# EAGLE design untitled (EAGLE 9.6.2)
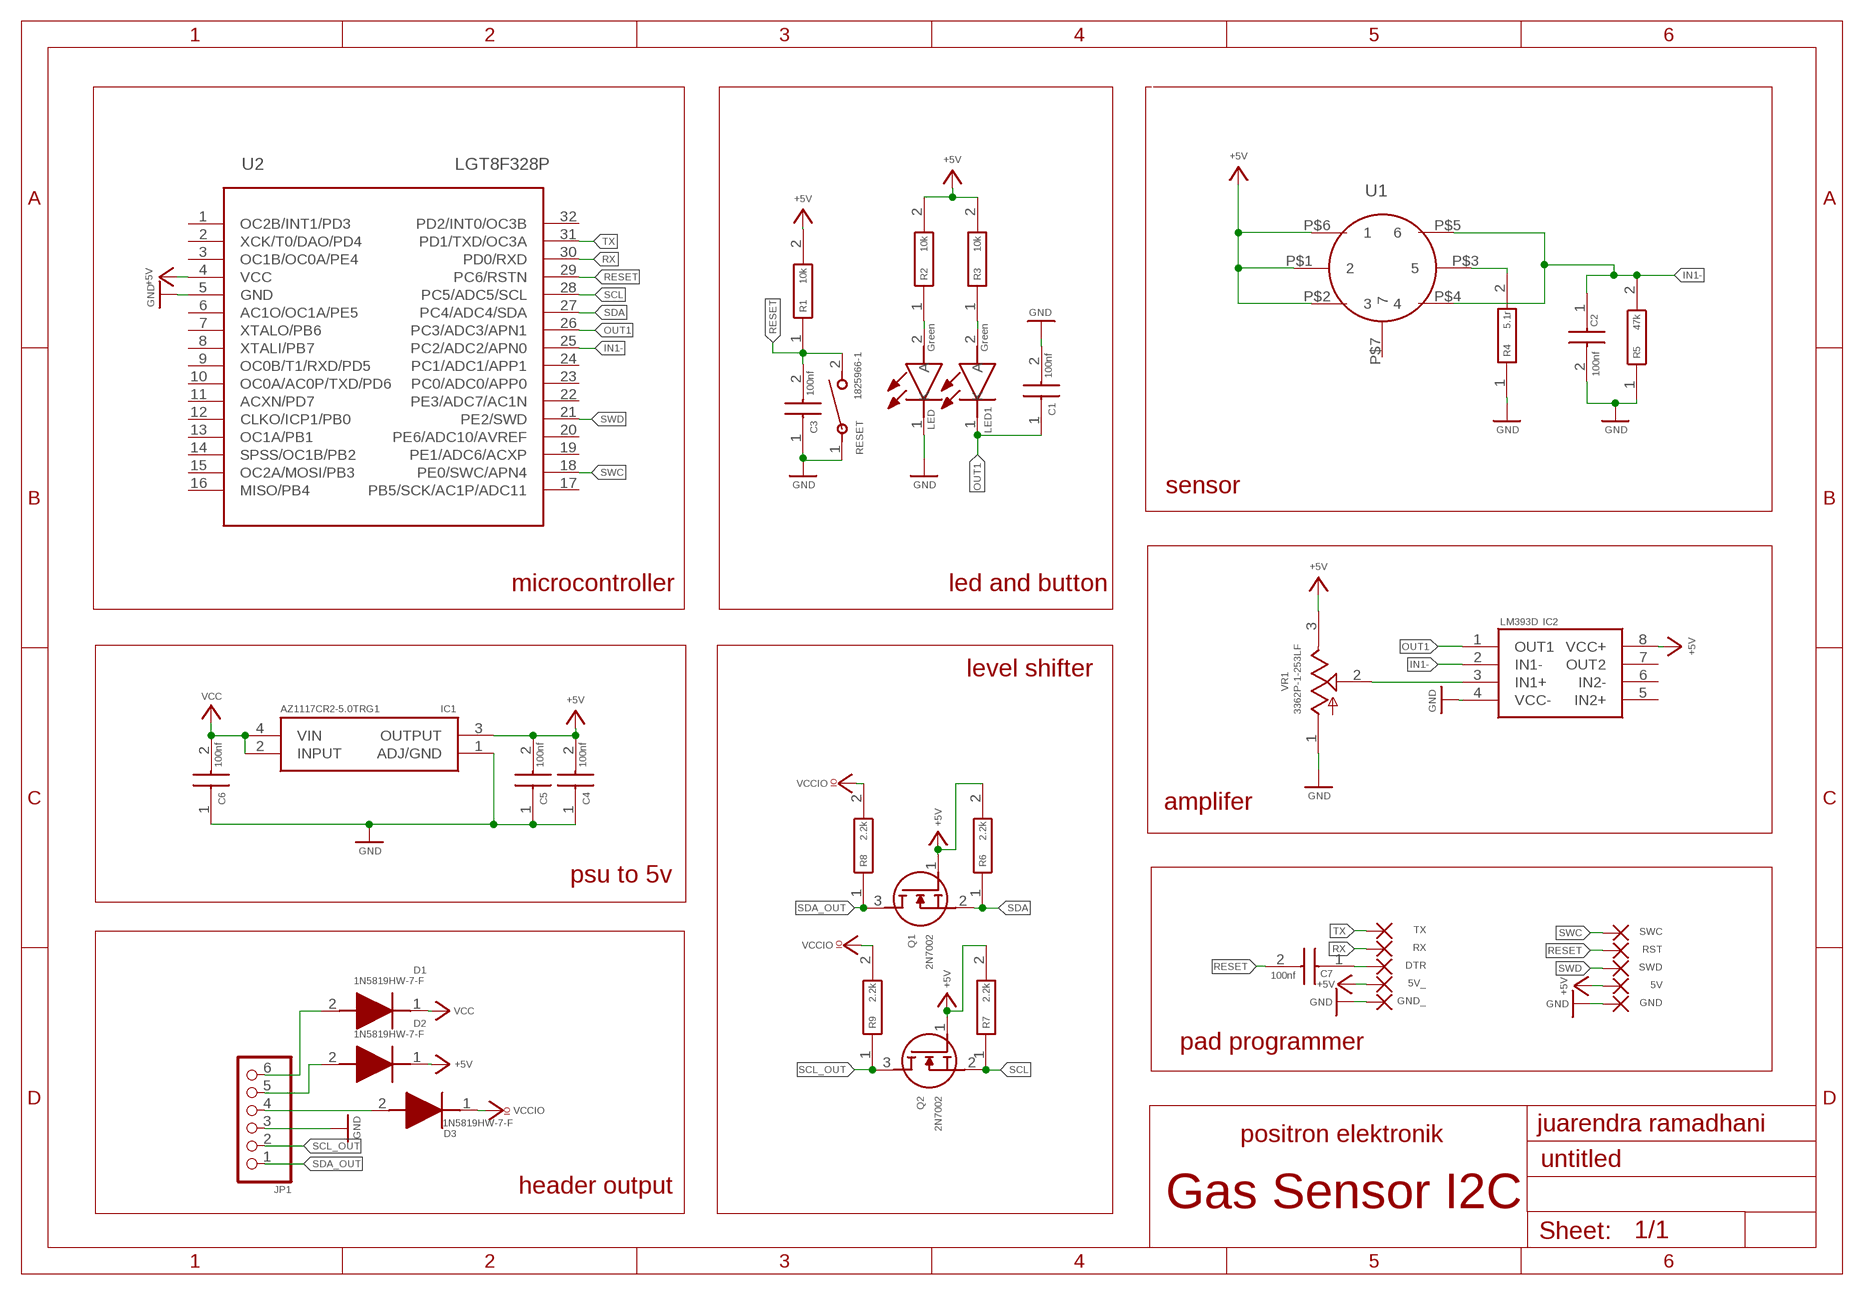
[diagram p0: schematic, sheet 1]

## Parts
5V  SMD2  [SMD1,27-2,54]
5V_  SMD2  [SMD1,27-2,54]
C1  100nf  CGA3E3X7S2A104M080AB  [CAPC1608X90N]
C2  100nf  CGA3E3X7S2A104M080AB  [CAPC1608X90N]
C3  100nf  CGA3E3X7S2A104M080AB  [CAPC1608X90N]
C4  100nf  CGA3E3X7S2A104M080AB  [CAPC1608X90N]
C5  100nf  CGA3E3X7S2A104M080AB  [CAPC1608X90N]
C6  100nf  CGA3E3X7S2A104M080AB  [CAPC1608X90N]
C7  100nf  CGA3E3X7S2A104M080AB  [CAPC1608X90N]
D1  1N5819HW-7-F  [SOD3716X145N]
D2  1N5819HW-7-F  [SOD3716X145N]
D3  1N5819HW-7-F  [SOD3716X145N]
DTR  SMD2  [SMD1,27-2,54]
GND  SMD2  [SMD1,27-2,54]
GND_  SMD2  [SMD1,27-2,54]
IC1  AZ1117CR2-5.0TRG1  [AP738133Y13]
IC2  LM393D  [SOIC127P600X175-8N]
JP1  PINHD-1X6  [1X06]
LED  Green  150080BS75000  [LEDC2012X80N]
LED1  Green  150080BS75000  [LEDC2012X80N]
Q1  2N7002  [SOT95P280X125-3N]
Q2  2N7002  [SOT95P280X125-3N]
R1  10k  CRCW060310K0FKEI  [RESC1608X50N]
R2  10k  CRCW060310K0FKEI  [RESC1608X50N]
R3  10k  CRCW060310K0FKEI  [RESC1608X50N]
R4  5.1r  RT0603DRE075R1L  [RESC1608X55N]
R5  47k  AC0603FR-7W47KL  [RESC1608X55N]
R6  2.2k  CR0603-FX-2201ELF  [RESC1608X55N]
R7  2.2k  CR0603-FX-2201ELF  [RESC1608X55N]
R8  2.2k  CR0603-FX-2201ELF  [RESC1608X55N]
R9  2.2k  CR0603-FX-2201ELF  [RESC1608X55N]
RESET  1825966-1  [SWDIP2_256X170P100]
RST  SMD2  [SMD1,27-2,54]
RX  SMD2  [SMD1,27-2,54]
SWC  SMD2  [SMD1,27-2,54]
SWD  SMD2  [SMD1,27-2,54]
TX  SMD2  [SMD1,27-2,54]
U1  MQ-SOCKET  [TQFP32-08]
U2  LGT8F328P  [TQFP32-08]
VR1  3362P-1-253LF  [TRIM_3362P-1-253LF]

## Nets
+5V: 5V.1(P) 5V_.1(P) C4.2 C5.2 D2.1(K) IC1.3(OUTPUT) IC2.8(VCC+) Q1.1(G) Q2.1(G) R1.2 R2.2 R3.2 R6.2 R7.2 U1.P$1 U1.P$2 U1.P$6 U2.4(VCC) VR1.3(CW)
GND: C1.2 C2.2 C3.1 C4.1 C5.1 C6.1 GND.1(P) GND_.1(P) IC1.1(ADJ/GND) IC2.4(VCC-) JP1.3 LED.1(K) R4.1 R5.1 RESET.1 U2.5(GND) VR1.1(CCW)
IN1-: C2.1 IC2.2(IN1-) R5.2 U1.P$4 U1.P$5 U2.25(PC2/ADC2/APN0)
N$1: LED.2(A) R2.1
N$2: LED1.2(A) R3.1
N$3: R4.2 U1.P$3
N$4: D1.2(A) JP1.6
N$5: D3.2(A) JP1.4
N$6: IC2.3(IN1+) VR1.2(WIPER)
N$7: D2.2(A) JP1.5
N$8: C7.1 DTR.1(P)
OUT1: C1.1 IC2.1(OUT1) LED1.1(K) U2.26(PC3/ADC3/APN1)
RESET: C3.2 C7.2 R1.1 RESET.2 RST.1(P) U2.29(PC6/RSTN)
RX: RX.1(P) U2.30(PD0/RXD)
SCL: Q2.2(S) R7.1 U2.28(PC5/ADC5/SCL)
SCL_OUT: JP1.2 Q2.3(D) R9.1
SDA: Q1.2(S) R6.1 U2.27(PC4/ADC4/SDA)
SDA_OUT: JP1.1 Q1.3(D) R8.1
SWC: SWC.1(P) U2.18(PE0/SWC/APN4)
SWD: SWD.1(P) U2.21(PE2/SWD)
TX: TX.1(P) U2.31(PD1/TXD/OC3A)
VCC: C6.2 D1.1(K) IC1.2(INPUT) IC1.4(VIN)
VCCIO: D3.1(K) R8.2 R9.2
Unconnected: IC2.5(IN2+) IC2.6(IN2-) IC2.7(OUT2) U1.P$7 U2.1(OC2B/INT1/PD3) U2.2(XCK/T0/DAO/PD4) U2.3(OC1B/OC0A/PE4) U2.6(AC1O/OC1A/PE5) U2.7(XTALO/PB6) U2.8(XTALI/PB7) U2.9(OC0B/T1/RXD/PD5) U2.10(OC0A/AC0P/TXD/PD6) U2.11(ACXN/PD7) U2.12(CLKO/ICP1/PB0) U2.13(OC1A/PB1) U2.14(SPSS/OC1B/PB2) U2.15(OC2A/MOSI/PB3) U2.16(MISO/PB4) U2.17(PB5/SCK/AC1P/ADC11) U2.19(PE1/ADC6/ACXP) U2.20(PE6/ADC10/AVREF) U2.22(PE3/ADC7/AC1N) U2.23(PC0/ADC0/APP0) U2.24(PC1/ADC1/APP1) U2.32(PD2/INT0/OC3B)

## Notes on the sheet
- sensor
- microcontroller | led and button
- level shifter
- amplifer
- psu to 5v
- pad programmer
- juarendra ramadhani
- positron elektronik
- header output
- Gas Sensor I2C

## Library data of the parts
5V 5V_ DTR GND GND_ RST RX SWC SWD TX = wirepad1:SMD2: SMD PAD
C1-C7 = CGA3E3X7S2A104M080AB:CGA3E3X7S2A104M080AB: Multilayer Ceramic Chip Capacitors, Capacitance=0.1uF, LxWxT:1.6x0.8x0.8mm Source: Datasheet; DESCRIPTION: Multilayer Ceramic Chip Capacitors, Capacitance=0.1uF, LxWxT:1.6x0.8x0.8mm; HEIGHT: 0.9mm; MANUFACTURER_NAME: TDK; MANUFACTURER_PART_NUMBER: CGA3E3X7S2A104M080AB; MOUSER_PART_NUMBER: 810-CGA3E3X7S2A104AB; MOUSER_PRICE-STOCK: https://www.mouser.co.uk/ProductDetail/TDK/CGA3E3X7S2A104M080AB?qs=6JAMGB%252BEdkwRRFLL6ULUHQ%3D%3D
D1-D3 = 1N5819HW-7-F:1N5819HW-7-F: Diode Schottky 1A 40V SOD123 Diodes Inc 1N5819HW-7-F, SMT Schottky Diode, 40V 1A, 2-Pin SOD-123 Source: Datasheet <https://www.diodes.com//assets/Datasheets/1N5819HW.pdf>; DESCRIPTION: Diode Schottky 1A 40V SOD123 Diodes Inc 1N5819HW-7-F, SMT Schottky Diode, 40V 1A, 2-Pin SOD-123; HEIGHT: 1.45mm; MANUFACTURER_NAME: Diodes Incorporated; MANUFACTURER_PART_NUMBER: 1N5819HW-7-F; MOUSER_PART_NUMBER: 621-1N5819HW-F; MOUSER_PRICE-STOCK: https://www.mouser.co.uk/ProductDetail/Diodes-Incorporated/1N5819HW-7-F?qs=NQ47qNm99eDyWTEd07miYA%3D%3D
IC1 = AZ1117CR2-5.0TRG1:AZ1117CR2-5.0TRG1: Linear Voltage Regulator IC Positive Fixed 1 Output 1A SOT-89-3 Source: Datasheet <https://www.diodes.com//assets/Datasheets/AZ1117C.pdf>; DESCRIPTION: Linear Voltage Regulator IC Positive Fixed 1 Output 1A SOT-89-3; HEIGHT: 1.6mm; MANUFACTURER_NAME: Diodes Incorporated; MANUFACTURER_PART_NUMBER: AZ1117CR2-5.0TRG1; MOUSER_PART_NUMBER: 621-AZ1117CR25.0TRG1; MOUSER_PRICE-STOCK: https://www.mouser.co.uk/ProductDetail/Diodes-Incorporated/AZ1117CR2-5.0TRG1?qs=lqAf%2FiVYw9jcPQErqCnZAA%3D%3D
IC2 = LM393D:LM393D: LM393D, Dual Comparator Open Collector 1.3us 12 V, 15 V, 18 V, 24 V, 28 V, 3 V, 5 V, 9 V 8-Pin SO Source: Datasheet <http://www.st.com/st-web-ui/static/active/en/resource/technical/document/datasheet/CD00000465.pdf>; DESCRIPTION: LM393D, Dual Comparator Open Collector 1.3us 12 V, 15 V, 18 V, 24 V, 28 V, 3 V, 5 V, 9 V 8-Pin SO; HEIGHT: 1.75mm; MANUFACTURER_NAME: STMicroelectronics; MANUFACTURER_PART_NUMBER: LM393D; MOUSER_PART_NUMBER: 511-LM393D; MOUSER_PRICE-STOCK: https://www.mouser.co.uk/ProductDetail/STMicroelectronics/LM393D?qs=htKRmzjvioSpfPyLiLnV1A%3D%3D
JP1 = pinhead:PINHD-1X6: PIN HEADER
LED LED1 = AccesControlNFC:150080BS75000: LED,Wurth Elektronik,150080BS75000 Wurth Elektronik 150080BS75000, WL-SMCW Series Blue LED, 470 nm 2012 (0805) Clear, Rectangle Lens SMD package Source: Datasheet <https://katalog.we-online.com/led/datasheet/150080BS75000.pdf>; DESCRIPTION: LED,Wurth Elektronik,150080BS75000 Wurth Elektronik 150080BS75000, WL-SMCW Series Blue LED, 470 nm 2012 (0805) Clear, Rectangle Lens SMD package; HEIGHT: 0.8mm; MANUFACTURER_NAME: Wurth Elektronik; MANUFACTURER_PART_NUMBER: 150080BS75000; MOUSER_PART_NUMBER: 710-150080BS75000; MOUSER_PRICE-STOCK: https://www.mouser.co.uk/ProductDetail/Wurth-Elektronik/150080BS75000?qs=2kOmHSv6VfT2tBo3UPVqAQ%3D%3D
Q1 Q2 = 2N7002:2N7002: This Power MOSFET is the second generation of STMicroelectronics unique single feature size strip-based process. The resulting transistor shows extremely high packing density for low onresistance, rugged avalanche characteristics and less critical alignment steps therefore a remarkable manufacturing reproducibility. Source: Datasheet <https://www.st.com/resource/en/datasheet/cd00005134.pdf>; DESCRIPTION: This Power MOSFET is the second generation of STMicroelectronics unique single feature size strip-based process. The resulting transistor shows extremely high packing density for low onresistance, rugged avalanche characteristics and less critical alignment steps therefore a remarkable manufacturing reproducibility.; HEIGHT: 1.25mm; MANUFACTURER_NAME: STMicroelectronics; MANUFACTURER_PART_NUMBER: 2N7002; MOUSER_PART_NUMBER: 511-2N7002; MOUSER_PRICE-STOCK: https://www.mouser.co.uk/ProductDetail/STMicroelectronics/2N7002?qs=gr8Zi5OG3MhbM22ee9cxCw%3D%3D
R1-R3 = CRCW060310K0FKEI:CRCW060310K0FKEI: Standard Thick Film Chip Resistors value 10K0 ohm. Source: Datasheet <http://www.vishay.com/docs/20035/dcrcwe3.pdf>; DESCRIPTION: Standard Thick Film Chip Resistors value 10K0 ohm.; HEIGHT: 0.5mm; MANUFACTURER_NAME: Vishay; MANUFACTURER_PART_NUMBER: CRCW060310K0FKEI; MOUSER_PART_NUMBER: 71-CRCW060310K0FKEI; MOUSER_PRICE-STOCK: https://www.mouser.co.uk/ProductDetail/Vishay-Dale/CRCW060310K0FKEI?qs=3qWEzBg5KnKofE%252B8acPBRA%3D%3D
R4 = RT0603DRE075R1L:RT0603DRE075R1L: Thin Film Resistors - SMD 1/10W 5.1 ohm .5% 50ppm Source: Datasheet; DESCRIPTION: Thin Film Resistors - SMD 1/10W 5.1 ohm .5% 50ppm; HEIGHT: 0.55mm; MANUFACTURER_NAME: YAGEO; MANUFACTURER_PART_NUMBER: RT0603DRE075R1L
R5 = AC0603FR-7W47KL:AC0603FR-7W47KL: AEC-Q200 qualified Moisture sensitivity level: MSL 1 AC series soldering is compliant with J-STD-020D Halogen free epoxy Source: Datasheet <https://www.yageo.com/upload/media/product/productsearch/datasheet/rchip/PYu-AC_51_RoHS_L_10.pdf>; DESCRIPTION: AEC-Q200 qualified Moisture sensitivity level: MSL 1 AC series soldering is compliant with J-STD-020D Halogen free epoxy; HEIGHT: 0.55mm; MANUFACTURER_NAME: YAGEO; MANUFACTURER_PART_NUMBER: AC0603FR-7W47KL
R6-R9 = CR0603-FX-2201ELF:CR0603-FX-2201ELF: BOURNS - CR0603-FX-2201ELF - RES, THICK FILM, 2K2, 1%, 0.1W, 0603 Source: Datasheet <https://www.bourns.com/pdfs/chpreztr.pdf>; DESCRIPTION: BOURNS - CR0603-FX-2201ELF - RES, THICK FILM, 2K2, 1%, 0.1W, 0603; HEIGHT: 0.55mm; MANUFACTURER_NAME: Bourns; MANUFACTURER_PART_NUMBER: CR0603-FX-2201ELF; MOUSER_PART_NUMBER: 652-CR0603FX-2201ELF; MOUSER_PRICE-STOCK: https://www.mouser.co.uk/ProductDetail/Bourns/CR0603-FX-2201ELF?qs=zx2075yZkZKUzLkJq4yLqg%3D%3D
RESET = Switches:1825966-1; BUILT_BY: EMA_UL_Team; CATEGORY: Tactile Switches; COPYRIGHT: Copyright (C) 2016 Accelerated Designs. All rights reserved; DESCRIPTION: FSMCH=3.5 X 6.0 X 4.3 TACT SWITCH, HT; MANUFACTURER_PART_NUMBER: 1825966-1; PART_STATUS: active; SERIES: Unknown; VENDOR: TE Connectivity
U1 = MQ-Socket:MQ-SOCKET: Check availability <https://tokopedia.link/r7RVFgTy0Qb>
U2 = LGT8F328P:LGT8F328P: Check availability <https://pricing.snapeda.com/parts/LGT8F328P/Arduino/view-part?ref=eda>; AVAILABILITY: Not in stock; CHECK_PRICES: https://www.snapeda.com/parts/LGT8F328P/Arduino/view-part/?ref=eda; MF: Arduino; MP: LGT8F328P; PACKAGE: Package; PRICE: None; SNAPEDA_LINK: https://www.snapeda.com/parts/LGT8F328P/Arduino/view-part/?ref=snap
VR1 = 3362P-1-253LF:3362P-1-253LF: Check availability <https://pricing.snapeda.com/parts/3362P-1-253LF/Bourns/view-part?ref=eda>; AVAILABILITY: In Stock; CHECK_PRICES: https://www.snapeda.com/parts/3362P-1-253LF/Bourns/view-part/?ref=eda; DESCRIPTION: 1/4 Sq, Thru-Hole, TRIMMER, 25 Kilohms, Cermet, Single Turn | Bourns 3362P-1-253LF; MF: Bourns; MP: 3362P-1-253LF; PACKAGE: 3362P-1 Bourns Inc.; PRICE: None; SNAPEDA_LINK: https://www.snapeda.com/parts/3362P-1-253LF/Bourns/view-part/?ref=snap

## Board
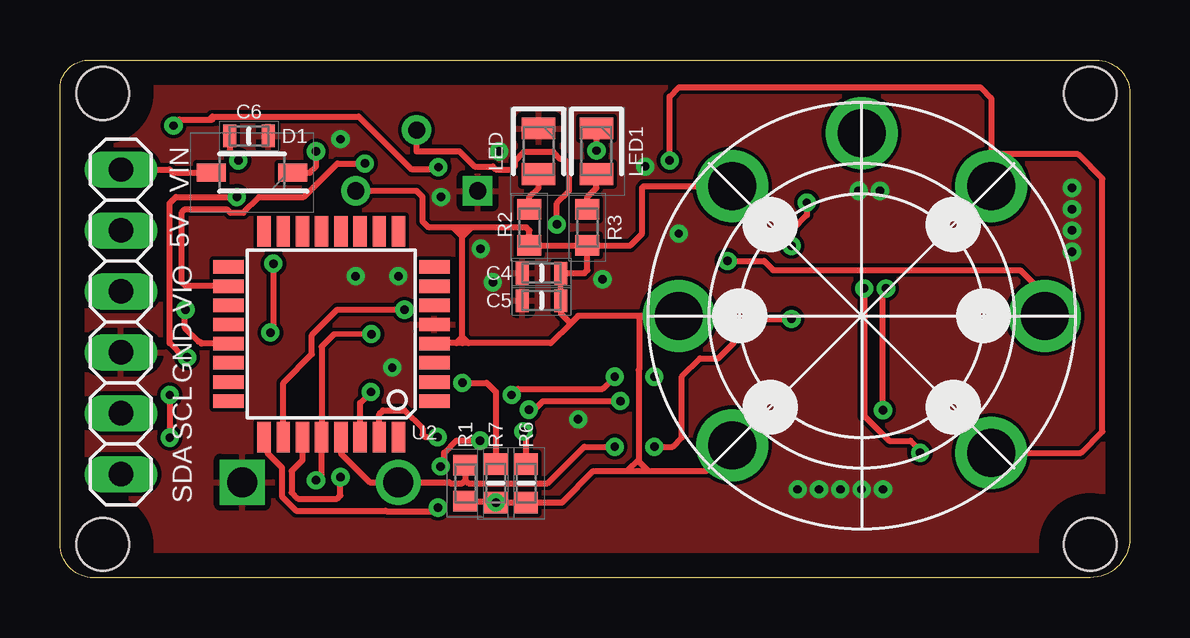
[diagram p1: board, top side]
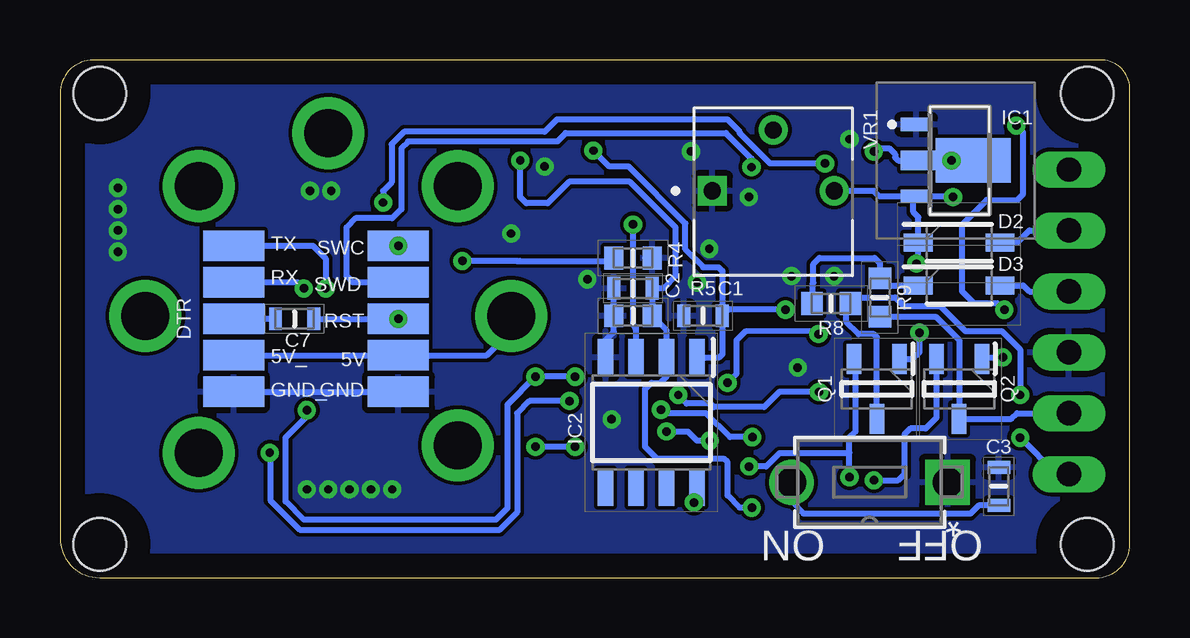
[diagram p2: board, bottom side, seen from below]

Size 44.58 x 21.59 mm. Coordinates in mm from the lower left corner, seen from the top.
Outline: 1.14,21.59 43.18,21.59 arc-90 44.58,20.19 44.58,1.65 arc-90 42.93,0 1.4,0 arc-90 0,1.4 0,20.32 arc-90 1.14,21.59
Copper layers (1*16): Top 0.035mm / dielectric 1.5mm / Bottom 0.035mm
Design rules "default *": minimum track width 6mil, minimum drill 0.35mm, track to track 6mil, track to pad 6mil, pad to pad 6mil, via to via 6mil, smd to smd 6mil, copper to edge 40mil, drill to drill 6mil, minimum pad ring 10mil, minimum via ring 8mil, stop-mask expansion 4mil, vias tented up to drill 0.36mm, thermal gap 10mil
Holes 2.2 mm at 42.93,1.4 42.93,20.19 1.78,20.19 1.78,1.4

### Footprints (pad centres in the part's own frame; a part is rotated, then mirrored left to right if it is on the bottom)
SMD1,27-2,54 = smd 1.27 x 2.54: 1 0,0
CAPC1608X90N = smd 0.54 x 0.94: 1 -0.8,0; 2 0.8,0
SOD3716X145N = smd 1.2 x 0.75: 1 -1.7,0; 2 1.7,0
AP738133Y13 = smd 0.55 x 1.3: 1 -1.5,-0.394; 3 1.5,-0.394 | smd 0.8 x 1.475: 2 0,-0.306 | smd 1.85 x 3.125: 4 0,1.994
SOIC127P600X175-8N = smd 1.525 x 0.65: 1 -2.712,1.905; 2 -2.712,0.635; 3 -2.712,-0.635; 4 -2.712,-1.905; 5 2.712,-1.905; 6 2.712,-0.635; 7 2.712,0.635; 8 2.712,1.905
1X06 = drill 1.016 long: 1 -6.35,0; 2 -3.81,0; 3 -1.27,0; 4 1.27,0; 5 3.81,0; 6 6.35,0
LEDC2012X80N = smd 0.9 x 1.4: 1 -0.95,0; 2 0.95,0
SOT95P280X125-3N = smd 1.25 x 0.6: 1 -1.25,0.95; 2 -1.25,-0.95; 3 1.25,0
RESC1608X50N = smd 0.85 x 1: 1 -0.75,0; 2 0.75,0
RESC1608X55N = smd 0.8 x 0.95: 1 -0.8,0; 2 0.8,0
RESC1608X55N' = smd 0.9 x 0.95: 1 -0.8,0; 2 0.8,0
SWDIP2_256X170P100 = drill 1.245 pad 1.753 square: 1 -6.502,0 | drill 1.245 pad 1.753: 2 0,0
TQFP32-08 = drill 2: P$1 -7.62,0; P$2 -5.397,-5.397; P$3 7.62,0; P$4 5.397,-5.715; P$5 5.397,5.397; P$6 -5.397,5.397; P$7 0,7.62
TQFP32-08' = smd 1.27 x 0.559: 1 -4.293,2.8; 2 -4.293,2; 3 -4.293,1.2; 4 -4.293,0.4; 5 -4.293,-0.4; 6 -4.293,-1.2; 7 -4.293,-2; 8 -4.293,-2.8; 17 4.293,-2.8; 18 4.293,-2; 19 4.293,-1.2; 20 4.293,-0.4; 21 4.293,0.4; 22 4.293,1.2; 23 4.293,2; 24 4.293,2.8 | smd 0.559 x 1.27: 9 -2.8,-4.293; 10 -2,-4.293; 11 -1.2,-4.293; 12 -0.4,-4.293; 13 0.4,-4.293; 14 1.2,-4.293; 15 2,-4.293; 16 2.8,-4.293; 25 2.8,4.293; 26 2,4.293; 27 1.2,4.293; 28 0.4,4.293; 29 -0.4,4.293; 30 -1.2,4.293; 31 -2,4.293; 32 -2.8,4.293
TRIM_3362P-1-253LF = drill 0.714 square: 1 -2.54,0 | drill 0.714: 2 0,2.54; 3 2.54,0

### Placement (x,y rotation side)
5V  30.48,9.27 270 bottom
5V_  37.34,9.27 270 bottom
C1  17.78,10.92 180 bottom
C2  20.7,12.06 180 bottom
C3  5.46,3.81 270 bottom
C4  20.07,12.7 0 top
C5  20.07,11.56 0 top
C6  7.87,18.41 180 top
C7  34.8,10.79 0 bottom
D1  8,16.89 180 top
D2  7.11,13.97 0 bottom
D3  7.11,12.19 0 bottom
DTR  37.34,10.79 270 bottom
GND  30.48,7.75 270 bottom
GND_  37.34,7.75 90 bottom
IC1  8.51,17.4 270 bottom
IC2  19.94,6.48 270 bottom
JP1  2.54,10.67 90 top
LED  19.94,17.78 270 top
LED1  22.35,17.78 270 top
Q1  10.54,7.87 270 bottom
Q2  7.11,7.87 270 bottom
R1  16.89,3.94 270 top
R2  19.56,14.61 270 top
R3  21.97,14.61 270 top
R4  20.7,13.34 180 bottom
R5  20.7,10.92 0 bottom
R6  2.2k  [RESC1608X55N']  19.43,3.94 270 top
R7  2.2k  [RESC1608X55N']  18.16,3.94 270 top
R8  2.2k  [RESC1608X55N']  12.45,11.43 180 bottom
R9  2.2k  [RESC1608X55N']  10.41,11.68 90 bottom
RESET  14.1,3.98 180 bottom
RST  30.48,10.79 270 bottom
RX  37.34,12.32 270 bottom
SWC  30.48,13.84 270 bottom
SWD  30.48,12.32 270 bottom
TX  37.34,13.84 270 bottom
U1  33.4,10.92 0 top
U2  LGT8F328P  [TQFP32-08']  11.3,10.16 180 top
VR1  14.86,16.13 0 bottom

### Tracks (layer width: path | path; a pad name or v marks a point on that pad's centre or on a via)
+5V  (via drill 0.35)
  Top 0.254: 21.84,13.86 R2.2 19.56,14.48 19.43,14.61 17.15,14.61 | 21.84,13.86 R3.2 23.76,13.86 24.26,14.35 24.26,16.26 24.32,16.32 U1.P$6 | U2.4 15.62,9.78 16.51,9.78 | 17.02,9.78 16.76,9.78 | 16.76,9.78 16.51,9.78 | R1.2 18.11,3.19 R7.2 R6.2 20.92,3.14 22.23,4.45 23.62,4.45 | 17.02,9.78 20.45,9.78 21.27,10.6 | 21.27,10.6 21.59,10.92 24.13,10.92 | VR1.3 14.86,16.13 15.11,15.88 15.11,14.86 15.37,14.61 16.38,14.61 | v5.29,9.19 5.16,9.19 4.57,9.78 4.57,15.62 4.83,15.88 v7.37,15.88 | 16.76,9.78 16.76,10.03 | 16.76,10.03 16.76,14.22 | 16.76,14.61 16.76,14.22 | 17.02,9.78 16.76,10.03 | 16.76,10.03 16.51,9.78 | 16.76,14.61 16.38,14.61 | 17.15,14.61 16.76,14.61 | 16.76,14.22 17.15,14.61 | 16.76,14.22 16.38,14.61 | 21.84,13.86 21.97,13.73 21.97,12.83 21.84,12.7 C4.2 C5.2 20.87,11.01 21.27,10.6 | v8.89,13.1 8.89,10.35 v8.76,10.22 | U1.P$2 26.92,4.45 24.51,4.45 | 23.62,4.45 24.51,4.45 | U1.P$1 24.13,10.92 | 24.13,10.92 24.13,8.68 24.11,8.65 24.11,4.93 | 24.11,4.93 23.62,4.45 | 24.11,4.93 24.11,4.85 24.51,4.45
  Bottom 0.254: 9.02,15.9 IC1.3 7.39,15.9 v7.37,15.88 | 9.02,15.9 10.44,15.9 10.67,16.13 VR1.3 | 9.02,15.9 9.02,15.24 8.81,15.04 D2.1 8.81,13.18 v8.89,13.1 | 5V_.1 5V.1 26.8,9.27 25.78,10.29 U1.P$1 | Q2.1 6.1,9.19 v5.29,9.19 | IC2.8 18.03,3.26 R7.2 | Q1.1 9.04,9.12 8.76,9.4 v8.76,10.22
  other vias: 18.16,3.14
GND  (via drill 0.35)
  Bottom 0.254: GND_.1 GND.1 | 20.19,13.34 R4.1 | C2.2 R5.1 21.5,10.25 21.84,9.91 IC2.4
  other vias: 30.73,3.68 31.62,3.68 32.51,3.68 33.4,3.68 34.29,3.68 42.16,16.26 42.16,15.37 42.16,14.48 42.16,13.59 33.27,16.13 34.16,16.13 25.78,14.35 24.38,17.14 21.59,6.6 13.84,8.76 14.1,12.57 15.88,15.88 11.68,18.29 18.03,12.32 17.53,13.72 22.61,12.45 18.29,17.78 12.32,12.57
  pour Bottom: 0.13,21.59 44.32,21.59 44.32,0 0.13,0
  pour Top: 0.13,21.59 44.32,21.59 44.32,0 0.13,0
IN1-  (via drill 0.35)
  Top 0.254: U2.25 8.64,5.73 8.64,5.21 9.25,4.6 9.25,3.39 9.84,2.79 13.57,2.79 13.6,2.77 15.6,2.77 v15.75,2.92 | v25.4,17.4 25.4,20.07 25.78,20.45 38.35,20.45 38.8,20 38.8,17.27 | 38.8,17.27 U1.P$5 | U1.P$4 42.55,5.21 43.43,6.1 43.43,16.64 42.42,17.65 39.18,17.65 38.8,17.27
  Bottom 0.254: v15.75,2.92 16.26,2.92 16.76,3.43 16.76,4.83 16.89,4.95 19.69,4.95 20.19,5.46 20.19,7.87 19.94,8.13 19.56,8.13 19.3,8.38 IC2.2 19.3,10.33 R5.2 C2.1 19.43,12.06 18.92,12.57 18.92,14.61 20.83,16.51 23.37,16.51 24.26,15.62 25.15,15.62 25.4,15.88 v25.4,17.4
N$1
  Top 0.254: R2.1 19.56,15.88 19.94,16.26 LED.2
N$2
  Top 0.254: R3.1 21.97,15.88 22.35,16.26 LED1.2
N$3  (via drill 0.35)
  Top 0.254: v27.81,13.21 29.34,13.21 29.72,12.83 40.01,12.83 41.02,11.81 U1.P$3
  Bottom 0.254: 25.52,13.21 25.53,13.2 | R4.2 21.63,13.21 25.4,13.21 25.52,13.21 | 25.52,13.21 v27.81,13.21
N$4
  Top 0.254: JP1.6 4.57,17.02 4.7,16.89 D1.2
N$5
  Bottom 0.254: D3.2 4.45,12.19 4.19,11.94 JP1.4
N$6  (via drill 0.35)
  Top 0.254: v20.7,14.73 20.7,15.62 21.21,16.13 21.21,17.27 21.02,17.46 20.85,17.46 20.55,17.76 | VR1.2 14.86,17.78 16.64,17.78 17.27,17.14 18.03,17.14 18.16,17.02 18.8,17.02 18.96,17.18 18.96,17.4 19.32,17.76 20.55,17.76 | 20.53,17.78 20.55,17.76
  Bottom 0.254: IC2.3 20.57,10.33 20.58,10.33 20.58,10.42 20.7,10.54 v20.7,14.73
N$7
  Bottom 0.254: D2.2 4.7,13.97 4.19,14.48 JP1.5
N$8
  Bottom 0.254: C7.1 DTR.1
OUT1  (via drill 0.35)
  Top 0.254: U2.26 9.3,8.13 10.5,9.32 10.5,10.12 11.56,11.18 v14.35,11.18 | LED1.1 v22.35,17.81
  Bottom 0.254: IC2.1 17.1,9.19 16.98,9.31 C1.1 | v14.35,11.18 16.73,11.18 C1.1 | C1.1 16.98,12.79 17.15,12.95 17.78,12.95 18.52,13.69 18.52,14.77 20.89,17.14 21.69,17.14 v22.35,17.81
RESET  (via drill 0.35)
  Top 0.254: U2.29 11.7,5.19 12.91,3.98 RESET.2 16.21,3.98 16.26,3.94 16.76,3.94 16.89,4.06 | R1.1 16.89,4.06 | 16.89,4.06 17.02,3.94 20.32,3.94 21.84,5.46 v23.11,5.46 | v24.77,5.46 25.53,5.46 25.91,5.84 25.91,8.38 26.67,9.14 27.43,9.14 28.07,9.78 28.07,10.03 28.83,10.79 RST.1
  Bottom 0.254: C3.2 6.3,3.01 6.65,2.67 13.59,2.67 14.1,3.17 RESET.2 | 34,10.78 C7.2 RST.1 | v23.11,5.46 v24.77,5.46
  other vias: 30.48,10.79
RX  (via drill 0.35)
  Top 0.254: U2.30 12.5,7.3 v12.95,7.75 | v18.82,7.62 19.07,7.87 22.61,7.87 v23.11,8.38 | v34.29,6.99 34.29,11.94 v34.42,12.06
  Bottom 0.254: v12.95,7.75 14.61,7.75 15.24,7.11 17.33,7.11 17.49,7.26 18.46,7.26 v18.82,7.62 | v23.11,8.38 v24.77,8.38 25.93,7.21 25.93,2.9 26.42,2.41 34.42,2.41 35.18,3.17 35.18,5.84 34.29,6.73 v34.29,6.99 | v34.42,12.06 34.67,12.32 RX.1
SCL  (via drill 0.35)
  Top 0.254: v10.67,4.06 10.9,4.3 U2.28 10.9,9.63 11.41,10.14 v12.97,10.16 | v16.76,8.13 17.78,8.13 18.16,7.75 R7.1
  Bottom 0.254: Q2.2 8.06,6.67 8.51,6.22 9.14,6.22 9.4,5.97 9.4,4.32 9.65,4.06 v10.67,4.06 | v16.76,8.13 16.38,8.51 16.38,9.91 16,10.29 12.83,10.31 v12.97,10.16
SCL_OUT
  Bottom 0.254: R9.1 8.09,10.88 7.11,9.91 Q2.3 4.93,6.62 4.7,6.86 JP1.2
SDA  (via drill 0.35)
  Top 0.254: U2.27 10.1,4.9 9.65,4.45 9.65,3.56 9.91,3.29 11.55,3.29 11.68,3.43 v11.68,4.19 | R6.1 19.43,5.97 v19.3,6.1 | v17.5,5.72 16.51,5.72 16,5.21 16,4.78 v15.86,4.64
  Bottom 0.254: 11.56,9.06 Q1.2 11.43,9.06 11.43,6.1 11.68,5.84 11.68,5.21 | v11.68,4.19 11.68,5.21 | v19.3,6.1 18.42,6.1 18.04,5.72 v17.5,5.72 | 11.68,5.21 11.7,5.19 14.6,5.19 15.16,4.64 v15.86,4.64
SDA_OUT  (via drill 0.35)
  Top 0.254: v4.57,7.62 v4.57,5.84
  Bottom 0.254: v4.57,5.84 3.05,4.32 JP1.1 | v4.57,7.62 4.57,9.53 5.33,10.29 6.86,10.29 7.87,11.3 9.4,11.3 9.78,11.68 11.39,11.68 R8.1 11.81,11.27 11.81,10.67 11.3,10.15 10.67,10.15 10.54,10.03 Q1.3
SWC  (via drill 0.35)
  Top 0.254: U2.18 5.24,12.16 5.08,12.32 5.08,15.24 5.21,15.37 6.94,15.37 7.09,15.22 7.64,15.22 8.3,15.88 10.16,15.88 11.56,17.27 v12.7,17.27 | v31.12,15.64 31.12,15.11 30.48,14.48 SWC.1
  Bottom 0.254: v12.7,17.27 14.99,17.27 16.26,18.54 16.26,18.59 16.76,19.1 23.88,19.1 24.38,18.6 30.24,18.6 30.76,18.07 30.76,16.48 31.12,16.13 v31.12,15.64
  other vias: 30.48,13.84
SWD  (via drill 0.35)
  Top 0.254: U2.21 5.9,9.76 5.82,9.85 5.78,9.85 5.21,10.41 5.21,11.15 v5.23,11.18 | v4.73,18.85 4.98,19.1 6.22,19.1 | 6.22,19.1 6.35,19.1 | 6.22,19.1 6.35,19.23 12.45,19.23 14.66,17.02 15.66,17.02 v15.77,17.12
  Bottom 0.254: v5.23,11.18 5.48,11.43 6.48,11.43 6.99,11.94 6.99,14.73 5.97,15.75 4.7,15.75 4.45,16 4.45,18.57 v4.73,18.85 | v15.77,17.12 15.77,17.48 16.83,18.54 23.51,18.54 23.86,18.19 30.07,18.19 30.35,17.91 30.35,15.37 30.73,14.99 32.26,14.99 32.64,14.61 32.64,12.57 32.39,12.32 SWD.1
TX  (via drill 0.35)
  Top 0.254: U2.31 13.3,6.83 13.46,6.99 14.35,6.99 15.11,6.22 15.11,5.97 15.22,5.86 v15.73,5.86 | v19.54,7 19.77,7 20.13,7.37 v23.35,7.37 | v33.51,12.06 33.51,6.75 34.54,5.71 35.43,5.71 35.84,5.31 v35.84,5.21
  Bottom 0.254: v15.73,5.86 16.66,5.86 17.65,6.86 19.39,6.86 v19.54,7 | v23.35,7.37 25.02,7.37 25.53,6.86 25.53,2.73 26.25,2.01 34.59,2.01 35.81,3.24 35.81,5.18 v35.84,5.21 | TX.1 34.04,13.84 33.51,13.31 v33.51,12.06
VCC  (via drill 0.35)
  Top 0.254: D1.1 10.41,16.89 10.67,17.14 v10.67,17.78 | C6.2 7.07,17.76 v7.43,17.4
  Bottom 0.254: v10.67,17.78 10.54,17.91 10.03,17.91 9.78,17.65 9.78,17.53 9.65,17.4 IC1.2 v7.43,17.4 IC1.4
VCCIO
  Bottom 0.254: D3.1 10.12,12.19 R9.2 10.41,13.12 10.63,13.34 12.93,13.34 13.19,13.08 13.19,12.3 13.21,12.28 13.21,11.47 R8.2

### Text on the board
tPlace: VIN | 5V | VIO | GND | SCL | SDA